# Altium project Acoustic Signal LocalizationV2.PrjPcb
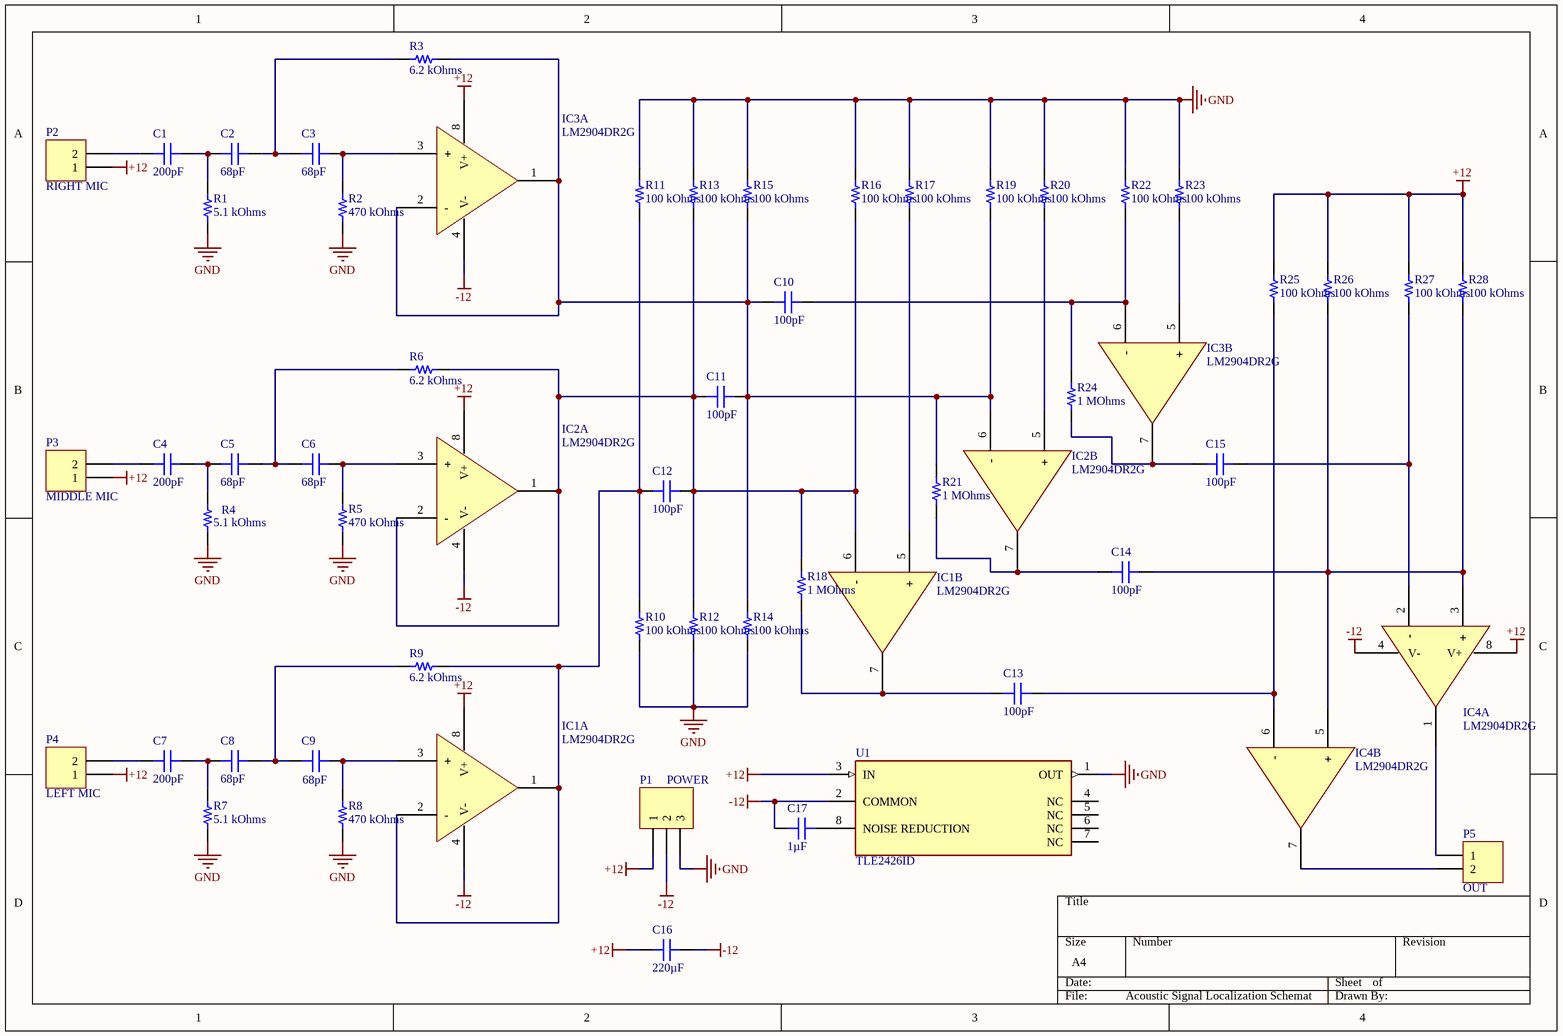
[diagram p0: Acoustic Signal Localization Schematic.SchDoc]
1 sheet, 55 parts. Net scope: global (net labels, ports and power ports of the same name join across sheets).
Board file: Acoustic Signal Localization PCB.PcbDoc

## Sheet Acoustic Signal Localization Schematic.SchDoc
size A4; SheetNumber: 1; SheetTotal: 1

### Parts
C1  200pF  [CAP 1210_3225 - 1.6MM]
C2  68pF  [CAP 1210_3225 - 1.6MM]
C3  68pF  [CAP 1210_3225 - 1.6MM]
C4  200pF  [CAP 1210_3225 - 1.6MM]
C5  68pF  [CAP 1210_3225 - 1.6MM]
C6  68pF  [CAP 1210_3225 - 1.6MM]
C7  200pF  [CAP 1210_3225 - 1.6MM]
C8  68pF  [CAP 1210_3225 - 1.6MM]
C9  68pF  [CAP 1210_3225 - 1.6MM]
C10  100pF  [CAP 1210_3225 - 1.8MM]
C11  100pF  [CAP 1210_3225 - 1.8MM]
C12  100pF  [CAP 1210_3225 - 1.8MM]
C13  100pF  [CAP 1210_3225 - 1.8MM]
C14  100pF  [CAP 1210_3225 - 1.8MM]
C15  100pF  [CAP 1210_3225 - 1.8MM]
C16  220µF  [CAP 1210_3225 - 2.8MM]
C17  1µF  [CAP 1210_3225 - 2.8MM]
IC1  LM2904DR2G  [TI SOIC-8 D]  (parts A,B of 2)
IC2  LM2904DR2G  [TI SOIC-8 D]  (parts A,B of 2)
IC3  LM2904DR2G  [TI SOIC-8 D]  (parts A,B of 2)
IC4  LM2904DR2G  [TI SOIC-8 D]  (parts A,B of 2)
P1  POWER  [HDR1X3]
P2  RIGHT MIC  [HDR1X2]
P3  MIDDLE MIC  [HDR1X2]
P4  LEFT MIC  [HDR1X2]
P5  OUT  [HDR1X2]
R1  5.1 kOhms  [RES 1210_3225]
R2  470 kOhms  [RES 1210_3225]
R3  6.2 kOhms  [RES 1210_3225]
R4  5.1 kOhms  [RES 1210_3225]
R5  470 kOhms  [RES 1210_3225]
R6  6.2 kOhms  [RES 1210_3225]
R7  5.1 kOhms  [RES 1210_3225]
R8  470 kOhms  [RES 1210_3225]
R9  6.2 kOhms  [RES 1210_3225]
R10  100 kOhms  [RES 1210_3225]
R11  100 kOhms  [RES 1210_3225]
R12  100 kOhms  [RES 1210_3225]
R13  100 kOhms  [RES 1210_3225]
R14  100 kOhms  [RES 1210_3225]
R15  100 kOhms  [RES 1210_3225]
R16  100 kOhms  [RES 1210_3225]
R17  100 kOhms  [RES 1210_3225]
R18  1 MOhms  [RES 1210_3225]
R19  100 kOhms  [RES 1210_3225]
R20  100 kOhms  [RES 1210_3225]
R21  1 MOhms  [RES 1210_3225]
R22  100 kOhms  [RES 1210_3225]
R23  100 kOhms  [RES 1210_3225]
R24  1 MOhms  [RES 1210_3225]
R25  100 kOhms  [RES 1210_3225]
R26  100 kOhms  [RES 1210_3225]
R27  100 kOhms  [RES 1210_3225]
R28  100 kOhms  [RES 1210_3225]
U1  TLE2426ID  [FP-D0008A-IPC_B]

### Nets
+12: C16.1 IC1.8(V+) IC2.8(V+) IC3.8(V+) IC4.8(V+) P1.1 P2.1 P3.1 P4.1 R25.2 R26.2 R27.2 R28.2 U1.3(IN)
-12: C16.2 C17.1 IC1.4(V-) IC2.4(V-) IC3.4(V-) IC4.4(V-) P1.2 U1.2(COMMON)
GND: P1.3 R1.1 R2.1 R4.1 R5.1 R7.1 R8.1 R10.1 R11.2 R12.1 R13.2 R14.1 R15.2 R16.2 R17.2 R19.2 R20.2 R22.2 R23.2 U1.1(OUT)
NetC1_1: C1.1 P2.2
NetC1_2: C1.2 C2.1 R1.2
NetC2_2: C2.2 C3.1 R3.2
NetC3_2: C3.2 IC3.3(+) R2.2
NetC4_1: C4.1 P3.2
NetC4_2: C4.2 C5.1 R4.2
NetC5_2: C5.2 C6.1 R6.2
NetC6_2: C6.2 IC2.3(+) R5.2
NetC7_1: C7.1 P4.2
NetC7_2: C7.2 C8.1 R7.2
NetC8_2: C8.2 C9.1 R9.2
NetC9_2: C9.2 IC1.3(+) R8.2
NetC10_1: C10.1 C11.2 IC2.6(-) IC3.1(OUTA) IC3.2(-) R3.1 R14.2 R15.1 R19.1 R21.2
NetC10_2: C10.2 IC3.6(-) R22.1 R24.2
NetC11_1: C11.1 C12.2 IC1.6(-) IC2.1(OUTA) IC2.2(-) R6.1 R12.2 R13.1 R16.1 R18.2
NetC12_1: C12.1 IC1.1(OUTA) IC1.2(-) R9.1 R10.2 R11.1
NetC13_1: C13.1 IC1.7(OUTB) R18.1
NetC13_2: C13.2 IC4.6(-) R25.1
NetC14_1: C14.1 IC2.7(OUTB) R21.1
NetC14_2: C14.2 IC4.3(+) IC4.5(+) R26.1 R28.1
NetC15_1: C15.1 IC3.7(OUTB) R24.1
NetC15_2: C15.2 IC4.2(-) R27.1
NetC17_2: C17.2 U1.8(NOISE_REDUCTION)
NetIC1_5: IC1.5(+) R17.1
NetIC2_5: IC2.5(+) R20.1
NetIC3_5: IC3.5(+) R23.1
NetIC4_1: IC4.1(OUTA) P5.1
NetIC4_7: IC4.7(OUTB) P5.2

Not connected (* = marked no-connect by the designer): U1 4(NC) 5(NC) 6(NC) 7(NC)

### Library data of the parts
C1 C4 C7 = C1210X201JBGACAUTO: CAP CER 1210 200PF 630V C0G 5% F; Manufacturer: KEMET; Temperature Coefficient: C0G, NP0; Part Number: C1210X201JBGACAUTO; Value: 200pF; Applications: Automotive, Boardflex Sensitive; Capacitance: 200pF; ComponentLink1Description: Datasheet; ComponentLink1URL: https://api.kemet.com/component-edge/download/datasheet/C1210X201JBGACAUTO.pdf; ComponentLink2Description: DigiKey Link; ComponentLink2URL: http://digikey.com/product-detail/en/kemet/C1210X201JBGACAUTO/399-16763-1-ND/8110129; Device Package: 1210 (3225 Metric); Features: Low ESL, Soft Termination, High Voltage; LastUpdated: 2.09.2020 01:10:34; Lifecycle Status: Active; Minimum Order: 1; Mounting Type: Surface Mount, MLCC; Operating Temperature: -55°C ~ 125°C; Package / Case: 1210 (3225 Metric); Packaging: TapeAndReel; PartId: 24877; Part Status: Active; Price: 0.85; Ratings: AEC-Q200; Series: SMD Auto C0G HV Flex; Size / Dimension: 0.130" L x 0.102" W (3.30mm x 2.60mm); Supplier 1: DigiKey; Supplier Part Number 1: 399-16763-1-ND; Thickness (Max): 0.057" (1.45mm); Tolerance: ±5%; Voltage - Rated: 630V
C2 C3 C5 C6 C8 C9 = C1210C681KGRACTU: CAP CER 680PF 2KV X7R 1210; Manufacturer: KEMET; Tolerance: ±10%; Voltage - Rated: 2000V (2kV); Part Number: C1210C681KGRACTU; Value: 68pF; Applications: General Purpose; Capacitance: 680pF; ComponentLink1Description: Datasheet; ComponentLink1URL: https://api.kemet.com/component-edge/download/datasheet/C1210C681KGRACTU.pdf; ComponentLink2Description: DigiKey Link; ComponentLink2URL: http://digikey.com/product-detail/en/kemet/C1210C681KGRACTU/399-3441-1-ND/721312; Device Package: 1210 (3225 Metric); Features: Low ESL, High Voltage; LastUpdated: 2.09.2020 01:10:34; Lifecycle Status: Active; Minimum Order: 1; Mounting Type: Surface Mount, MLCC; Operating Temperature: -55°C ~ 125°C; Package / Case: 1210 (3225 Metric); Packaging: TapeAndReel; PartId: 24867; Part Status: Active; Price: 0.23; Series: SMD Comm X7R HV; Size / Dimension: 0.126" L x 0.098" W (3.20mm x 2.50mm); Supplier 1: DigiKey; Supplier Part Number 1: 399-3441-1-ND; Temperature Coefficient: X7R; Thickness (Max): 0.061" (1.55mm)
C10-C15 = VJ1210A101JXGAT5Z: CAP CER 100PF 1KV C0G/NP0 1210; Manufacturer: Vishay Vitramon; Temperature Coefficient: C0G, NP0; Tolerance: ±5%; Voltage - Rated: 1000V (1kV); Part Number: VJ1210A101JXGAT5Z; Value: 100pF; Applications: General Purpose; Capacitance: 100pF; ComponentLink1Description: Datasheet; ComponentLink1URL: http://www.vishay.com/docs/45197/vjhvarcguard.pdf; ComponentLink2Description: DigiKey Link; ComponentLink2URL: http://digikey.com/product-detail/en/vishay-vitramon/VJ1210A101JXGAT5Z/720-1035-1-ND/1560037; Device Package: 1210 (3225 Metric); Features: High Voltage; LastUpdated: 2.09.2020 01:10:36; Lifecycle Status: Active; Minimum Order: 1; Mounting Type: Surface Mount, MLCC; Operating Temperature: -55°C ~ 125°C; Package / Case: 1210 (3225 Metric); Packaging: TapeAndReel; PartId: 24731; Part Status: Active; Price: 0.42; Series: VJ HVArc Guard™; Size / Dimension: 0.126" L x 0.098" W (3.20mm x 2.50mm); Supplier 1: DigiKey; Supplier Part Number 1: 720-1035-1-ND; Thickness (Max): 0.067" (1.70mm)
C16 = GRM32EC80E227ME05L: CAP CER 220UF 2.5V X6S 1210; Manufacturer: Murata Electronics; Tolerance: ±20%; Part Number: GRM32EC80E227ME05L; Value: 220µF; Applications: General Purpose; Capacitance: 220µF; ComponentLink1Description: Datasheet; ComponentLink1URL: https://search.murata.co.jp/Ceramy/image/img/A01X/G101/ENG/GRM32EC80E227ME05-01.pdf; ComponentLink2Description: DigiKey Link; ComponentLink2URL: http://digikey.com/product-detail/en/murata-electronics/GRM32EC80E227ME05L/490-13971-1-ND/6155801; Device Package: 1210 (3225 Metric); LastUpdated: 2.09.2020 01:10:53; Lifecycle Status: Active; Minimum Order: 1; Mounting Type: Surface Mount, MLCC; Operating Temperature: -55°C ~ 105°C; Package / Case: 1210 (3225 Metric); Packaging: TapeAndReel; PartId: 23666; Part Status: Active; Price: 0.72; Series: GRM; Size / Dimension: 0.126" L x 0.098" W (3.20mm x 2.50mm); Supplier 1: DigiKey; Supplier Part Number 1: 490-13971-1-ND; Temperature Coefficient: X6S; Thickness (Max): 0.110" (2.80mm); Voltage - Rated: 2.5V
C17 = CL32B105KCJNNNE: CAP CER 1UF 100V X7R 1210; Manufacturer: Samsung Electro-Mechanics; Tolerance: ±10%; Part Number: CL32B105KCJNNNE; Value: 1µF; Applications: General Purpose; Capacitance: 1µF; ComponentLink1Description: Datasheet; ComponentLink1URL: http://www.samsungsem.com/kr/support/product-search/mlcc/CL32B105KCJNNNE.jsp; ComponentLink2Description: DigiKey Link; ComponentLink2URL: http://digikey.com/product-detail/en/samsung-electro-mechanics/CL32B105KCJNNNE/1276-1812-1-ND/3889898; Device Package: 1210 (3225 Metric); LastUpdated: 2.09.2020 01:10:53; Lifecycle Status: Active; Minimum Order: 1; Mounting Type: Surface Mount, MLCC; Operating Temperature: -55°C ~ 125°C; Package / Case: 1210 (3225 Metric); Packaging: TapeAndReel; PartId: 23662; Part Status: Active; Price: 0.14; Series: CL; Size / Dimension: 0.126" L x 0.098" W (3.20mm x 2.50mm); Supplier 1: DigiKey; Supplier Part Number 1: 1276-1812-1-ND; Temperature Coefficient: X7R; Thickness (Max): 0.106" (2.70mm); Voltage - Rated: 100V
IC1-IC4 = LM2904DR2G: IC OPAMP GP 2 CIRCUIT 8SOIC; Manufacturer: ON Semiconductor; Amplifier Type: General Purpose; Current - Input Bias: 45nA; Current - Output / Channel: 40mA; Current - Supply: 1.5mA; Gain Bandwidth Product: 1MHz; Number of Circuits: 2; Slew Rate: 0.6V/µs; Voltage - Input Offset: 2mV; Voltage - Supply, Single/Dual (±): 3V ~ 32V, ±1.5V ~ 16V; Part Number: LM2904DR2G; ComponentLink1Description: Datasheet; ComponentLink1URL: http://www.onsemi.com/pub/Collateral/LM358-D.PDF; ComponentLink2Description: DigiKey Link; ComponentLink2URL: http://digikey.com/product-detail/en/on-semiconductor/LM2904DR2G/LM2904DR2GOSCT-ND/917932; Device Package: 8-SOIC (0.154", 3.90mm Width); LastUpdated: 9.01.2020 02:06:42; Lifecycle Status: Active; Minimum Order: 1; Mounting Type: Surface Mount; Operating Temperature: -40°C ~ 105°C; Package / Case: 8-SOIC (0.154", 3.90mm Width); Packaging: ReReel; PartId: 15; Part Status: Active; Price: 0.00; Series: -; Supplier 1: DigiKey; Supplier Part Number 1: LM2904DR2GOSCT-ND; Supplier Device Package: 8-SOIC
P1 = Header 3: Header, 3-Pin; LatestRevisionDate: 17-Jul-2002; LatestRevisionNote: Re-released for DXP Platform.; Publisher: Altium Limited
P2-P5 = Header 2: Header, 2-Pin; LatestRevisionDate: 17-Jul-2002; LatestRevisionNote: Re-released for DXP Platform.; Publisher: Altium Limited
R1 R4 R7 = RK73B2ETTD512J: RES 5.1K OHM 5% 1/2W 1210; Manufacturer: KOA Speer Electronics, Inc.; Power (Watts): 0.5W, 1/2W; Temperature Coefficient: ±200ppm/°C; Part Number: RK73B2ETTD512J; ComponentLink1Description: Datasheet; ComponentLink1URL: http://www.koaspeer.com/catimages/Products/RK73B/RK73B.pdf; ComponentLink2Description: DigiKey Link; ComponentLink2URL: http://digikey.com/product-detail/en/koa-speer-electronics-inc/RK73B2ETTD512J/2019-RK73B2ETTD512JCT-ND/10315189; Composition: Thick Film; Device Package: 1210 (3225 Metric); Features: Automotive AEC-Q200, Moisture Resistant; Height - Seated (Max): 0.028" (0.70mm); LastUpdated: 2.09.2020 01:26:17; Lifecycle Status: Active; Minimum Order: 1; Number of Terminations: 2; Operating Temperature: -55°C ~ 155°C; Package / Case: 1210 (3225 Metric); Packaging: TapeAndReel; Part Status: Active; Price: 0.02; Ratings: AEC-Q200; Resistance: 5.1 kOhms; Series: RK73B; Size / Dimension: 0.126" L x 0.063" W (3.20mm x 1.60mm); Supplier 1: DigiKey; Supplier Part Number 1: 2019-RK73B2ETTD512JCT-ND; Supplier Device Package: 1210; Tolerance: ±5%; Value: 5.1 kOhms
R2 R5 R8 = RMCF1210JT470K: RES 470K OHM 5% 1/3W 1210; Manufacturer: Stackpole Electronics Inc; Power (Watts): 0.333W, 1/3W; Temperature Coefficient: ±200ppm/°C; Part Number: RMCF1210JT470K; ComponentLink1Description: Datasheet; ComponentLink1URL: https://www.seielect.com/catalog/sei-rmcf_rmcp.pdf; ComponentLink2Description: DigiKey Link; ComponentLink2URL: http://digikey.com/product-detail/en/stackpole-electronics-inc/RMCF1210JT470K/RMCF1210JT470KCT-ND/6053332; Composition: Thick Film; Device Package: 1210 (3225 Metric); Features: Automotive AEC-Q200; Height - Seated (Max): 0.028" (0.70mm); LastUpdated: 2.09.2020 01:26:20; Lifecycle Status: Active; Minimum Order: 1; Number of Terminations: 2; Operating Temperature: -55°C ~ 155°C; Package / Case: 1210 (3225 Metric); Packaging: TapeAndReel; Part Status: Active; Price: 0.01; Ratings: AEC-Q200; Resistance: 470 kOhms; Series: RMCF; Size / Dimension: 0.126" L x 0.098" W (3.20mm x 2.50mm); Supplier 1: DigiKey; Supplier Part Number 1: RMCF1210JT470KCT-ND; Supplier Device Package: 1210; Tolerance: ±5%; Value: 470 kOhms
R3 R6 R9 = RK73B2ETTD622J: RES 6.2K OHM 5% 1/2W 1210; Manufacturer: KOA Speer Electronics, Inc.; Power (Watts): 0.5W, 1/2W; Temperature Coefficient: ±200ppm/°C; Part Number: RK73B2ETTD622J; ComponentLink1Description: Datasheet; ComponentLink1URL: http://www.koaspeer.com/catimages/Products/RK73B/RK73B.pdf; ComponentLink2Description: DigiKey Link; ComponentLink2URL: http://digikey.com/product-detail/en/koa-speer-electronics-inc/RK73B2ETTD622J/2019-RK73B2ETTD622JCT-ND/10315057; Composition: Thick Film; Device Package: 1210 (3225 Metric); Features: Automotive AEC-Q200, Moisture Resistant; Height - Seated (Max): 0.028" (0.70mm); LastUpdated: 2.09.2020 01:26:20; Lifecycle Status: Active; Minimum Order: 1; Number of Terminations: 2; Operating Temperature: -55°C ~ 155°C; Package / Case: 1210 (3225 Metric); Packaging: TapeAndReel; Part Status: Active; Price: 0.02; Ratings: AEC-Q200; Resistance: 6.2 kOhms; Series: RK73B; Size / Dimension: 0.126" L x 0.063" W (3.20mm x 1.60mm); Supplier 1: DigiKey; Supplier Part Number 1: 2019-RK73B2ETTD622JCT-ND; Supplier Device Package: 1210; Tolerance: ±5%; Value: 6.2 kOhms
R10-R17 R19 R20 R22 R23 R25-R28 = RMCF1210FT100K: RES 100K OHM 1% 1/3W 1210; Manufacturer: Stackpole Electronics Inc; Power (Watts): 0.333W, 1/3W; Temperature Coefficient: ±100ppm/°C; Part Number: RMCF1210FT100K; ComponentLink1Description: Datasheet; ComponentLink1URL: https://www.seielect.com/catalog/sei-packaging.pdf; ComponentLink2Description: DigiKey Link; ComponentLink2URL: http://digikey.com/product-detail/en/stackpole-electronics-inc/RMCF1210FT100K/RMCF1210FT100KCT-ND/1942841; Composition: Thick Film; Device Package: 1210 (3225 Metric); Features: Automotive AEC-Q200; Height - Seated (Max): 0.028" (0.70mm); LastUpdated: 2.09.2020 01:26:17; Lifecycle Status: Active; Minimum Order: 1; Number of Terminations: 2; Operating Temperature: -55°C ~ 155°C; Package / Case: 1210 (3225 Metric); Packaging: TapeAndReel; Part Status: Active; Price: 0.02; Ratings: AEC-Q200; Resistance: 100 kOhms; Series: RMCF; Size / Dimension: 0.126" L x 0.098" W (3.20mm x 2.50mm); Supplier 1: DigiKey; Supplier Part Number 1: RMCF1210FT100KCT-ND; Supplier Device Package: 1210; Tolerance: ±1%; Value: 100 kOhms
R18 R21 R24 = RK73B2ETTD105J: RES 1M OHM 5% 1/2W 1210; Manufacturer: KOA Speer Electronics, Inc.; Power (Watts): 0.5W, 1/2W; Temperature Coefficient: ±200ppm/°C; Part Number: RK73B2ETTD105J; ComponentLink1Description: Datasheet; ComponentLink1URL: http://www.koaspeer.com/catimages/Products/RK73B/RK73B.pdf; ComponentLink2Description: DigiKey Link; ComponentLink2URL: http://digikey.com/product-detail/en/koa-speer-electronics-inc/RK73B2ETTD105J/2019-RK73B2ETTD105JCT-ND/10315127; Composition: Thick Film; Device Package: 1210 (3225 Metric); Features: Automotive AEC-Q200, Moisture Resistant; Height - Seated (Max): 0.028" (0.70mm); LastUpdated: 2.09.2020 01:26:17; Lifecycle Status: Active; Minimum Order: 1; Number of Terminations: 2; Operating Temperature: -55°C ~ 155°C; Package / Case: 1210 (3225 Metric); Packaging: TapeAndReel; Part Status: Active; Price: 0.02; Ratings: AEC-Q200; Resistance: 1 MOhms; Series: RK73B; Size / Dimension: 0.126" L x 0.063" W (3.20mm x 1.60mm); Supplier 1: DigiKey; Supplier Part Number 1: 2019-RK73B2ETTD105JCT-ND; Supplier Device Package: 1210; Tolerance: ±5%; Value: 1 MOhms
U1 = CMP-04916-000027-1: IC VREF GND REF 20V 1% 8SOIC; Max Output Current: 20mA; Min Input Voltage: 4V; Temperature Coefficient: 35ppm/°C; Number of Channels: 1; Output Type: Adjustable; Operating Supply Current: 400uA; Min Output Voltage: 2V; Reference Type: Ground Reference (Virtual); Max Input Voltage: 40V; Length: 4.9mm; Package Quantity: 75; Tolerance: 1%; Output Current: 20mA; Max Output Voltage: 20V; Radiation Hardening: No; Max Operating Temperature: 125°C; Weight: 0.002677oz; Mount: Surface Mount; Case/Package: SOIC; Series: -; Number of Pins: 8; Width: 3.91mm; Reference Voltage: 20V; Packaging: Rail/Tube; REACH SVHC: No SVHC; Output Voltage: 20V; Lead Free: Lead Free; RoHS Compliant: Yes; Height: 1.58mm; Min Operating Temperature: -55°C